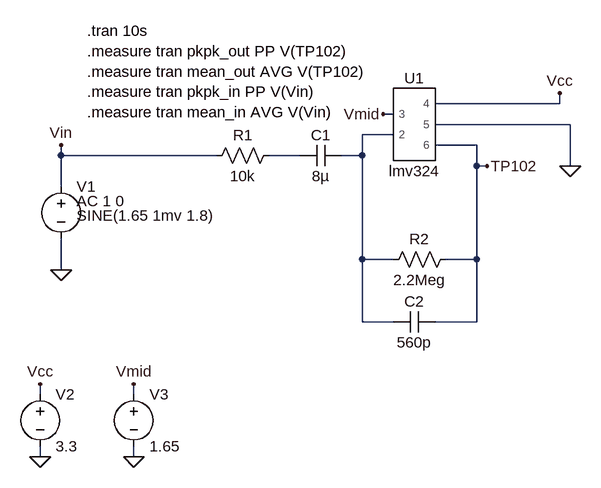
[diagram p0: schematic First_Gain_Stage.asc]
First_Gain_Stage.asc, the LTspice schematic file:
Version 4
SHEET 1 1220 752
WIRE 576 144 576 128
WIRE 576 144 384 144
WIRE 320 160 304 160
WIRE 592 176 384 176
WIRE 320 192 272 192
WIRE 448 208 384 208
WIRE -192 224 -192 208
WIRE 48 224 -192 224
WIRE 176 224 128 224
WIRE 272 224 272 192
WIRE 272 224 240 224
WIRE 448 240 448 208
WIRE 464 240 448 240
WIRE 592 240 592 176
WIRE -192 272 -192 224
WIRE 272 384 272 224
WIRE 320 384 272 384
WIRE 448 384 448 240
WIRE 448 384 400 384
WIRE -192 400 -192 352
WIRE 272 480 272 384
WIRE 320 480 272 480
WIRE 448 480 448 384
WIRE 448 480 384 480
WIRE -224 592 -224 576
WIRE -80 592 -80 576
WIRE -224 688 -224 672
WIRE -80 688 -80 672
FLAG -192 400 0
FLAG -192 208 Vin
FLAG 304 160 Vmid
FLAG -80 688 0
FLAG -80 576 Vmid
FLAG 464 240 TP102
FLAG 592 240 0
FLAG -224 688 0
FLAG -224 576 Vcc
FLAG 576 128 Vcc
SYMBOL voltage -192 256 R0
WINDOW 3 24 60 Left 2
WINDOW 123 24 38 Left 2
SYMATTR InstName V1
SYMATTR Value SINE(1.65 1mv 1.8)
SYMATTR Value2 AC 1 0
SYMBOL res 144 208 R90
WINDOW 0 0 56 VBottom 2
WINDOW 3 32 56 VTop 2
SYMATTR InstName R1
SYMATTR Value 10k
SYMBOL cap 240 208 R90
WINDOW 0 0 32 VBottom 2
WINDOW 3 32 32 VTop 2
SYMATTR InstName C1
SYMATTR Value 8µ
SYMBOL res 416 368 R90
WINDOW 0 0 56 VBottom 2
WINDOW 3 32 56 VTop 2
SYMATTR InstName R2
SYMATTR Value 2.2Meg
SYMBOL cap 384 464 R90
WINDOW 0 0 32 VBottom 2
WINDOW 3 32 32 VTop 2
SYMATTR InstName C2
SYMATTR Value 560p
SYMBOL voltage -80 576 R0
SYMATTR InstName V3
SYMATTR Value 1.65
SYMBOL LMV324 352 176 R0
SYMATTR InstName U1
SYMBOL voltage -224 576 R0
SYMATTR InstName V2
SYMATTR Value 3.3
TEXT -152 32 Left 2 !.tran 10s\n.measure tran pkpk_out PP V(TP102)\n.measure tran mean_out AVG V(TP102)\n.measure tran pkpk_in PP V(Vin)\n.measure tran mean_in AVG V(Vin)

The netlist it stands for:
* First_Gain_Stage.asc
V1 Vin 0 SINE(1.65 1mv 1.8) AC 1 0
R1 N002 Vin 10k
C1 N001 N002 8µ
R2 TP102 N001 2.2Meg
C2 TP102 N001 560p
V3 Vmid 0 1.65
XU1 Vmid N001 Vcc 0 TP102 lmv324  ; pins 3 2 4 5 6
V2 Vcc 0 3.3
.tran 10s
.measure tran pkpk_out PP V(TP102)
.measure tran mean_out AVG V(TP102)
.measure tran pkpk_in PP V(Vin)
.measure tran mean_in AVG V(Vin)
.lib /Users/matthollands/Library/Mobile Documents/com~apple~CloudDocs/PersonalProjects/EOGee/Github/EOGee/EOGee1/LTSpice_Model/LMV324.cir
.backanno
.end